# Altium schematic sheet Lesson_05_2.SchDoc
size A4
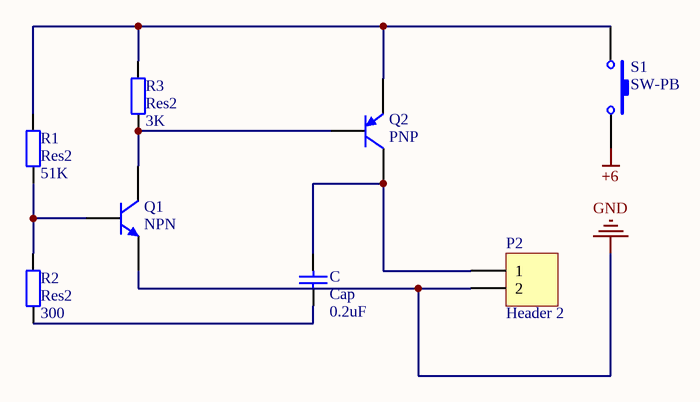
[diagram p0: Lesson_05_2.SchDoc]

## Parts
C  Cap  value 0.2uF  [RAD-0.3]
P2  Header 2  [HDR1X2]
Q1  NPN  [TO-226-AA]
Q2  PNP  [SOT-23B_N]
R1  Res2  value 51K  [AXIAL-0.4]
R2  Res2  value 300  [AXIAL-0.4]
R3  Res2  value 3K  [AXIAL-0.4]
S1  SW-PB  [SPST-2]

## Nets
+6: S1.2
GND: P2.2 Q1.3(E)
NetC_1: C.1 R2.1
NetC_2: C.2 P2.1 Q2.1(C)
NetQ1_1: Q1.1(C) Q2.2(B) R3.1
NetQ1_2: Q1.2(B) R1.1 R2.2
NetQ2_3: Q2.3(E) R1.2 R3.2 S1.1

## Library data of the parts
C = Cap: Capacitor; Published: 8-Jun-2000; LatestRevisionDate: 17-Jul-2002; LatestRevisionNote: Re-released for DXP Platform.; PackageReference: RAD-0.3; Publisher: Altium Limited; PackageDescription: Radial Cap, Thru-Hole; 2 Leads; 0.3 in Pin Spacing
P2 = Header 2: Header, 2-Pin; LatestRevisionDate: 17-Jul-2002; LatestRevisionNote: Re-released for DXP Platform.; Publisher: Altium Limited
Q1 = NPN: NPN Bipolar Transistor; Published: 8-Jun-2000; LatestRevisionDate: 17-Jul-2002; LatestRevisionNote: Re-released for DXP Platform.; PackageReference: TO-226-AA; Publisher: Altium Limited; PackageDescription: TO, Flat Index; 3 In-Line, Axial Leads; Body Dia. 4.8mm; Leads 0.55 x 0.51 mm (max); Code_JEDEC: TO-226-AA
Q2 = PNP: PNP Bipolar Transistor; Published: 8-Jun-2000; LatestRevisionDate: 29-May-2009; LatestRevisionNote: IPC-7351 Footprint Added.; PackageVersion: Aug-1999; PackageReference: SOT-23B; Publisher: Altium Limited; PackageDescription: 3-Pin SOT-23 Package 0.95 mm Pitch, 2.4 mm Lead Span
R1-R3 = Res2: Resistor; Published: 8-Jun-2000; LatestRevisionDate: 17-Jul-2002; LatestRevisionNote: Re-released for DXP Platform.; PackageReference: AXIAL-0.4; Publisher: Altium Limited; PackageDescription: Axial Device, Thru-Hole; 2 Leads; 0.4 in Pin Spacing
S1 = SW-PB: Switch; Published: 24-Mar-1999; LatestRevisionDate: 17-Jul-2002; LatestRevisionNote: Re-released for DXP Platform.; PackageReference: SPST-2; Publisher: Altium Limited; PackageDescription: Switch; 2 Leads